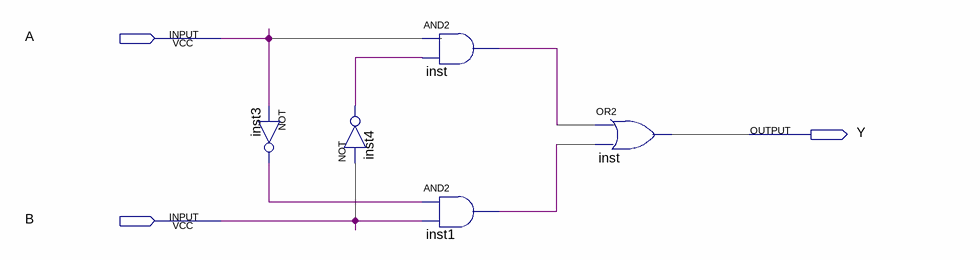
[diagram p0: schematic sheet]
// Quartus schematic LAB01DT_EXERCISE_Cau1.bdf as structural Verilog: 5 symbols, 3 pins
module LAB01DT_EXERCISE_Cau1 (
  input  A,
  input  B,
  output Y
);

  wire inst1_out, inst3_out, inst4_out, inst_out;

  not inst3 (inst3_out, A);
  // NOT inst4 has open pins: IN=open, OUT=inst4_out
  buf inst (inst_out, inst4_out);  // AND2 open: IN1
  and inst1 (inst1_out, inst3_out, B);
  // OR2 inst is placed but not wired
endmodule
